# EAGLE schematic p2gs-001 (EAGLE 9.6.2)
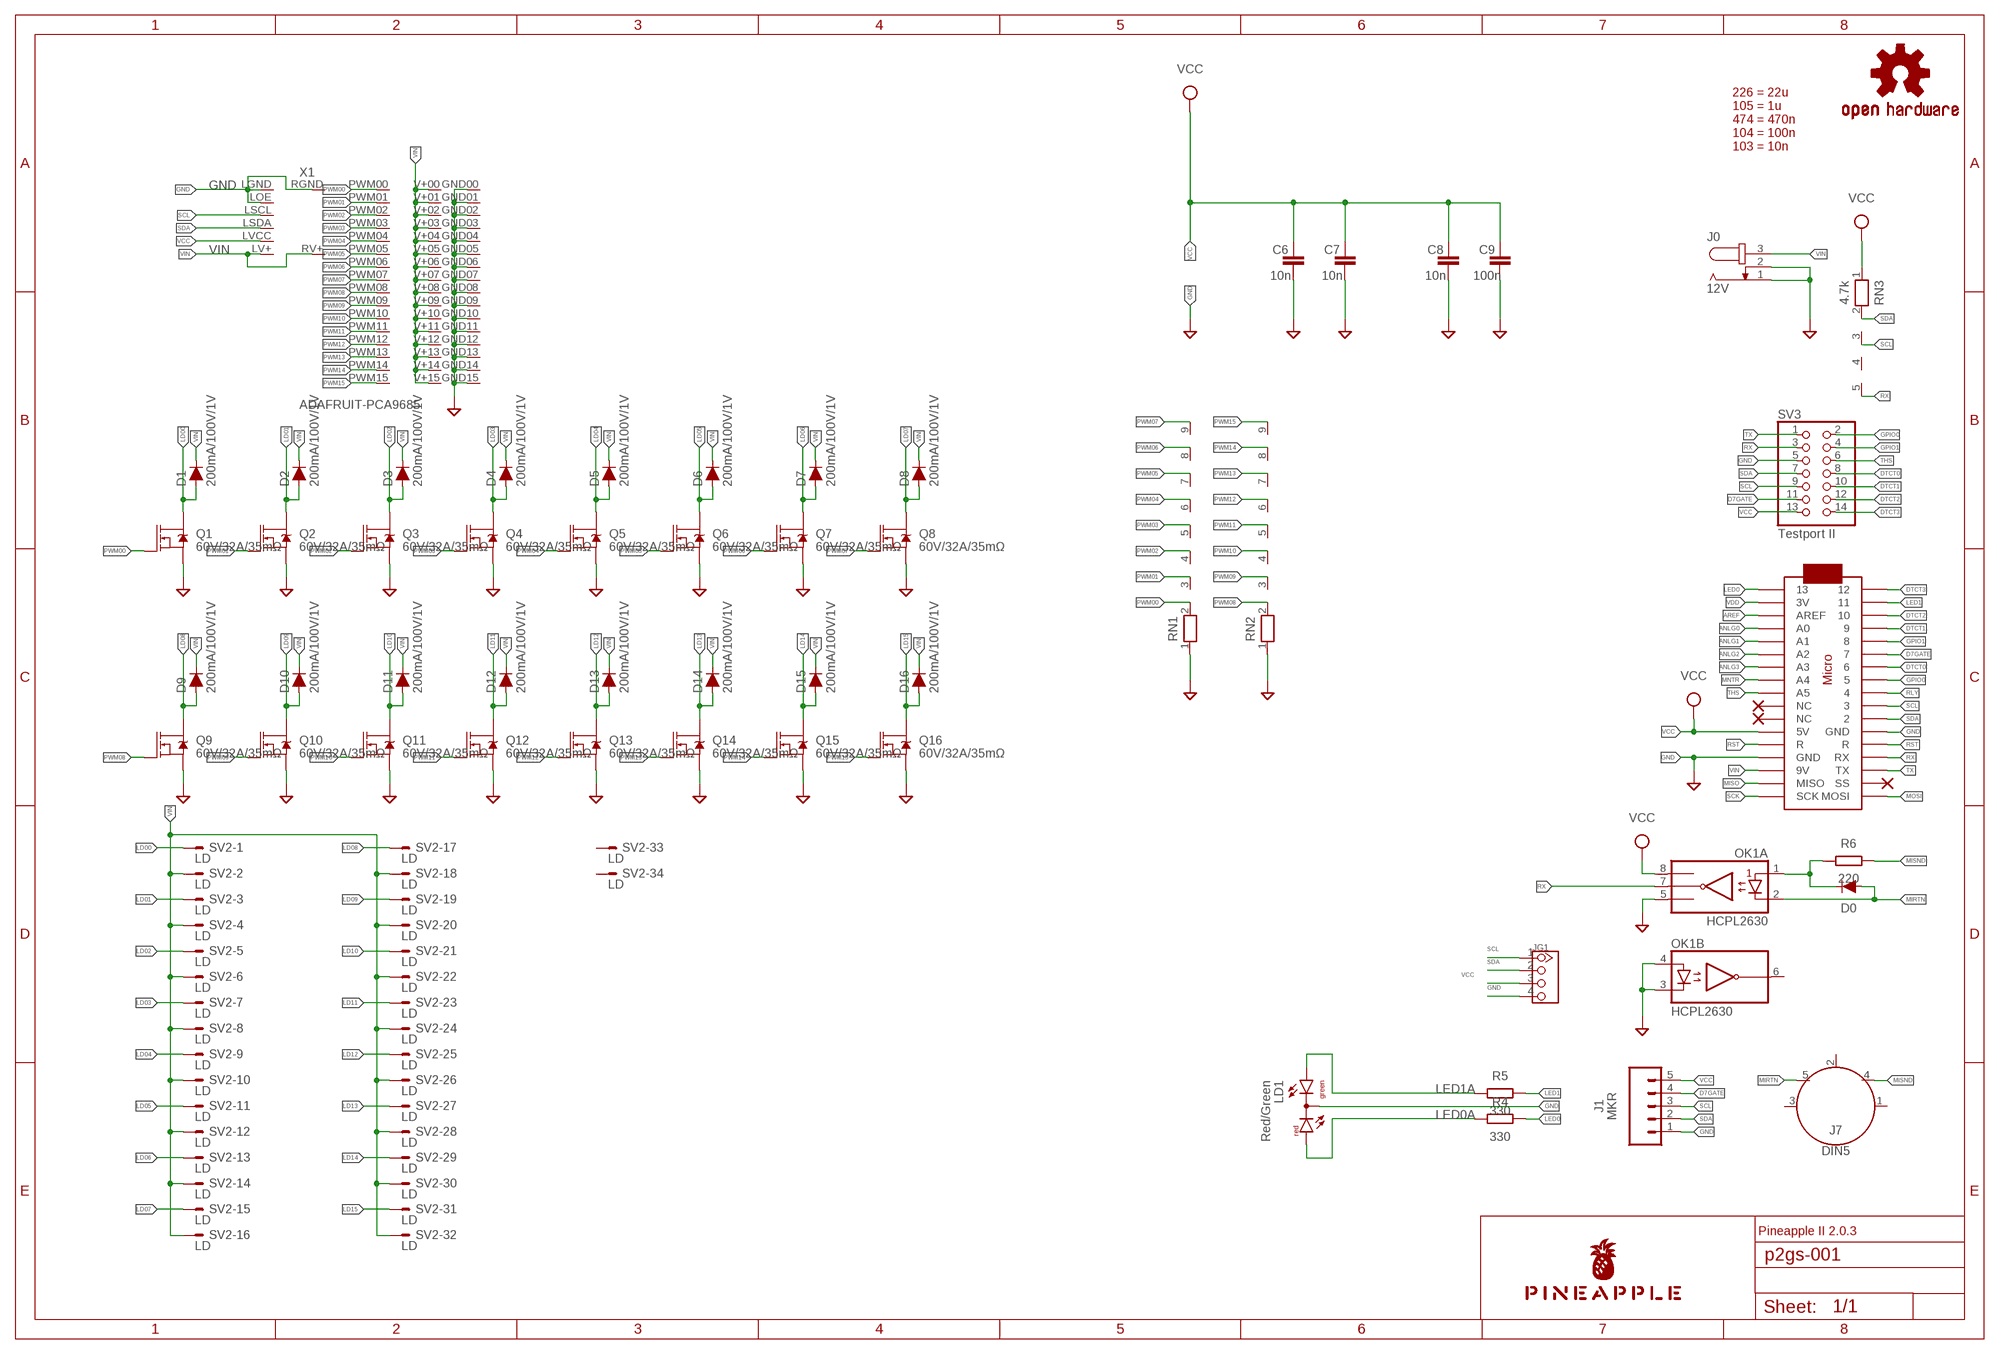
[diagram p0: schematic, sheet 1]

## Parts
C6  10n  C-EU025-024X044  [C025-024X044]
C7  10n  C-EU025-024X044  [C025-024X044]
C8  10n  C-EU025-024X044  [C025-024X044]
C9  100n  C-EU025-024X044  [C025-024X044]
D0  DIODE-1N4148  [DIODE-1N4148]
D1  200mA/100V/1V  DIODE-1N4148  [DIODE-1N4148]
D2  200mA/100V/1V  DIODE-1N4148  [DIODE-1N4148]
D3  200mA/100V/1V  DIODE-1N4148  [DIODE-1N4148]
D4  200mA/100V/1V  DIODE-1N4148  [DIODE-1N4148]
D5  200mA/100V/1V  DIODE-1N4148  [DIODE-1N4148]
D6  200mA/100V/1V  DIODE-1N4148  [DIODE-1N4148]
D7  200mA/100V/1V  DIODE-1N4148  [DIODE-1N4148]
D8  200mA/100V/1V  DIODE-1N4148  [DIODE-1N4148]
D9  200mA/100V/1V  DIODE-1N4148  [DIODE-1N4148]
D10  200mA/100V/1V  DIODE-1N4148  [DIODE-1N4148]
D11  200mA/100V/1V  DIODE-1N4148  [DIODE-1N4148]
D12  200mA/100V/1V  DIODE-1N4148  [DIODE-1N4148]
D13  200mA/100V/1V  DIODE-1N4148  [DIODE-1N4148]
D14  200mA/100V/1V  DIODE-1N4148  [DIODE-1N4148]
D15  200mA/100V/1V  DIODE-1N4148  [DIODE-1N4148]
D16  200mA/100V/1V  DIODE-1N4148  [DIODE-1N4148]
J0  12V  JACK-PLUG0  [SPC4077]
J1  MKR  CONN_05JST  [JST-5-PTH]
J7  DIN5  [DIN5-RA-PTH]
JG1  TWIG-4P-2.0'90D'  [4P-2.0-90D]
LD1  Red/Green  DUOLED-RG-C  [DUOLED-C-5MM]
LOGO1  OSHW-LOGOS-COPPER  [OSHW-LOGO-S_COPPER]
MC1  ARDUINOMICRO  [ARDUINOMICRO]
OK1  HCPL2630  [DIL08]
Q1  60V/32A/35mΩ  MOSFET-NCH-FQP30N06L  [TO220V]
Q2  60V/32A/35mΩ  MOSFET-NCH-FQP30N06L  [TO220V]
Q3  60V/32A/35mΩ  MOSFET-NCH-FQP30N06L  [TO220V]
Q4  60V/32A/35mΩ  MOSFET-NCH-FQP30N06L  [TO220V]
Q5  60V/32A/35mΩ  MOSFET-NCH-FQP30N06L  [TO220V]
Q6  60V/32A/35mΩ  MOSFET-NCH-FQP30N06L  [TO220V]
Q7  60V/32A/35mΩ  MOSFET-NCH-FQP30N06L  [TO220V]
Q8  60V/32A/35mΩ  MOSFET-NCH-FQP30N06L  [TO220V]
Q9  60V/32A/35mΩ  MOSFET-NCH-FQP30N06L  [TO220V]
Q10  60V/32A/35mΩ  MOSFET-NCH-FQP30N06L  [TO220V]
Q11  60V/32A/35mΩ  MOSFET-NCH-FQP30N06L  [TO220V]
Q12  60V/32A/35mΩ  MOSFET-NCH-FQP30N06L  [TO220V]
Q13  60V/32A/35mΩ  MOSFET-NCH-FQP30N06L  [TO220V]
Q14  60V/32A/35mΩ  MOSFET-NCH-FQP30N06L  [TO220V]
Q15  60V/32A/35mΩ  MOSFET-NCH-FQP30N06L  [TO220V]
Q16  60V/32A/35mΩ  MOSFET-NCH-FQP30N06L  [TO220V]
R4  330  R-EU_0204/5  [0204/5]
R5  330  R-EU_0204/5  [0204/5]
R6  220  R-EU_0204/5  [0204/5]
RN1  RN08  [RN-9]
RN2  RN08  [RN-9]
RN3  4.7k  RN04  [RN-5]
SV2  LD  ML34LE  [ML34L]
SV3  Testport II  PINHD-2X7  [2X07]
U$1  PINEAPPLE450_SILK  [PINEAPPLE450_SILK]
X1  ADAFRUIT-PCA9685  [ADAFRUIT-PCA9685-FOOTPRINT]

## Nets
ANLG0 [analog]: MC1.P$31(A0)
ANLG1 [analog]: MC1.P$30(A1)
ANLG2 [analog]: MC1.P$29(A2)
ANLG3 [analog]: MC1.P$28(A3)
AREF: MC1.P$32(AREF)
D7GATE: J1.4 MC1.P$6 SV3.11
DTCT0: MC1.P$7 SV3.8
DTCT1: MC1.P$4 SV3.10
DTCT2: MC1.P$3 SV3.12
DTCT3: MC1.P$1 SV3.14
GND [gnd]: C6.2 C7.2 C8.2 C9.2 J0.1 J0.2 J1.1 JG1.4 LD1.C MC1.P$12(GND) MC1.P$21(GND) OK1.3(B:C2) OK1.4(B:A2) OK1.5(A:GND) Q1.3(S) Q2.3(S) Q3.3(S) Q4.3(S) Q5.3(S) Q6.3(S) Q7.3(S) Q8.3(S) Q9.3(S) Q10.3(S) Q11.3(S) Q12.3(S) Q13.3(S) Q14.3(S) Q15.3(S) Q16.3(S) RN1.1 RN2.1 SV3.5 X1.GND00 X1.GND01 X1.GND02 X1.GND03 X1.GND04 X1.GND05 X1.GND06 X1.GND07 X1.GND08 X1.GND09 X1.GND10 X1.GND11 X1.GND12 X1.GND13 X1.GND14 X1.GND15 X1.LGND X1.LOE X1.RGND
GPIO0: MC1.P$8 SV3.2
GPIO1: MC1.P$5 SV3.4
LD00: D1.A Q1.2(D) SV2.1
LD01: D2.A Q2.2(D) SV2.3
LD02: D3.A Q3.2(D) SV2.5
LD03: D4.A Q4.2(D) SV2.7
LD04: D5.A Q5.2(D) SV2.9
LD05: D6.A Q6.2(D) SV2.11
LD06: D7.A Q7.2(D) SV2.13
LD07: D8.A Q8.2(D) SV2.15
LD08: D9.A Q9.2(D) SV2.17
LD09: D10.A Q10.2(D) SV2.19
LD10: D11.A Q11.2(D) SV2.21
LD11: D12.A Q12.2(D) SV2.23
LD12: D13.A Q13.2(D) SV2.25
LD13: D14.A Q14.2(D) SV2.27
LD14: D15.A Q15.2(D) SV2.29
LD15: D16.A Q16.2(D) SV2.31
LED0: MC1.P$34 R4.2
LED0A: LD1.AR R4.1
LED1: MC1.P$2 R5.2
LED1A: LD1.AX(AG) R5.1
MIDIINSND: D0.C OK1.1(A:A1) R6.1
MIRTN: D0.A J7.5 OK1.2(A:C1)
MISND: J7.4 R6.2
MISO: MC1.P$19(MISO)
MNTR: MC1.P$27(A4)
MOSI: MC1.P$17(MOSI)
PWM00: Q1.1(G) RN1.2 X1.PWM00
PWM01: Q2.1(G) RN1.3 X1.PWM01
PWM02: Q3.1(G) RN1.4 X1.PWM02
PWM03: Q4.1(G) RN1.5 X1.PWM03
PWM04: Q5.1(G) RN1.6 X1.PWM04
PWM05: Q6.1(G) RN1.7 X1.PWM05
PWM06: Q7.1(G) RN1.8 X1.PWM06
PWM07: Q8.1(G) RN1.9 X1.PWM07
PWM08: Q9.1(G) RN2.2 X1.PWM08
PWM09: Q10.1(G) RN2.3 X1.PWM09
PWM10: Q11.1(G) RN2.4 X1.PWM10
PWM11: Q12.1(G) RN2.5 X1.PWM11
PWM12: Q13.1(G) RN2.6 X1.PWM12
PWM13: Q14.1(G) RN2.7 X1.PWM13
PWM14: Q15.1(G) RN2.8 X1.PWM14
PWM15: Q16.1(G) RN2.9 X1.PWM15
RLY: MC1.P$9
RST: MC1.P$13(R) MC1.P$22(R)
RX: MC1.P$14(RX) OK1.7(A:VO1) RN3.5 SV3.3
SCK: MC1.P$18(SCK)
SCL: J1.3 JG1.1 MC1.P$10 RN3.3 SV3.9 X1.LSCL
SDA: J1.2 JG1.2 MC1.P$11 RN3.2 SV3.7 X1.LSDA
THS: MC1.P$26(A5) SV3.6
TX: MC1.P$15(TX) SV3.1
VCC [power]: C6.1 C7.1 C8.1 C9.1 J1.5 JG1.3 MC1.P$23(5V) OK1.8(A:VCC) RN3.1 SV3.13 X1.LVCC
VDD [power]: MC1.P$33(3V)
VIN [superpower]: D1.C D2.C D3.C D4.C D5.C D6.C D7.C D8.C D9.C D10.C D11.C D12.C D13.C D14.C D15.C D16.C J0.3 MC1.P$20(9V) SV2.2 SV2.4 SV2.6 SV2.8 SV2.10 SV2.12 SV2.14 SV2.16 SV2.18 SV2.20 SV2.22 SV2.24 SV2.26 SV2.28 SV2.30 SV2.32 X1.LV+ X1.RV+ X1.V+00 X1.V+01 X1.V+02 X1.V+03 X1.V+04 X1.V+05 X1.V+06 X1.V+07 X1.V+08 X1.V+09 X1.V+10 X1.V+11 X1.V+12 X1.V+13 X1.V+14 X1.V+15
Unconnected: J7.1 J7.2 J7.3 MC1.P$16(SS) MC1.P$24(NC) MC1.P$25(NC) OK1.6(B:VO2) RN3.4 SV2.33 SV2.34

## Notes on the sheet
- 226 = 22u
  105 = 1u
  474 = 470n
  104 = 100n
  103 = 10n
- Pineapple II 2.0.3

## Library data of the parts
C6-C9 = resistor:C-EU: CAPACITOR, European symbol
D0 = SparkFun-DiscreteSemi:DIODE: Diode These are standard reverse protection diodes and small signal diodes. SparkFun Products: SparkFun SparkPunk Sound Kit <https://www.sparkfun.com/products/11177> SparkFun ESP8266 Thing <https://www.sparkfun.com/products/13231>; PROD_ID: DIO-08378; VALUE: 200mA/100V/1V
D1-D16 = SparkFun-DiscreteSemi:DIODE: Diode These are standard reverse protection diodes and small signal diodes. SparkFun Products: SparkFun SparkPunk Sound Kit <https://www.sparkfun.com/products/11177> SparkFun ESP8266 Thing <https://www.sparkfun.com/products/13231>; PROD_ID: DIO-08378
J0 = con-jack:JACK-PLUG: DC POWER JACK Power Jack, DC, Right Angle, Through Hole, Rated 5A at 16VDC, PC Terminals Distributor: Farnell (www.Farnell.de) Drawing: 84N1161.pdf / 84N1162.pdf Manufacturer: SPC Technology (www.spctechnology.com) Type: SPC4077 / SPC 4078; OC_FARNELL: unknown; OC_NEWARK: unknown
J1 = SparkFun-Connectors:CONN_05: Multi connection point. Often used as Generic Header-pin footprint for 0.1 inch spaced/style header connections On any of the 0.1 inch spaced packages, you can populate with these: Break Away Headers - Straight <https://www.sparkfun.com/products/116> (PRT-00116) Break Away Male Headers - Right Angle <https://www.sparkfun.com/products/553> (PRT-00553) Female Headers <https://www.sparkfun.com/products/115> (PRT-00115) Break Away Headers - Machine Pin <https://www.sparkfun.com/products/117> (PRT-00117) Break Away Female Headers - Swiss Machine Pin <https://www.sparkfun.com/products/743> (PRT-00743) For SCREWTERMINALS and SPRING TERMINALS visit here: Screw Terimnals on SparkFun.com <https://www.sparkfun.com/search/results?term=Screw+Terminals> (5mm/3.5mm/2.54mm spacing) This device is also useful as a general connection point to wire up your design to another part of your project. Our various solder wires solder well into these plated through hole pads. Hook-Up Wire - Assortment (Stranded, 22 AWG) <https://www.sparkfun.com/products/11375> (PRT-11375) Hook-Up Wire - Assortment (Solid Core, 22 AWG) <https://www.sparkfun.com/products/11367> (PRT-11367) View the entire wire category on our website here <https://www.sparkfun.com/categories/141> Special notes: Molex polarized connector foot print use with SKU : PRT-08231 with associated crimp pins and housings. 1MM SMD Version SKU: PRT-10208; SF_ID: PRT-09917
J7 = SparkFun-Connectors:DIN5: DIN5 Connector - Female Right Angle (frequently used as a MIDI Jack connector) This type of connector and cable is frequently used for transmitting midi data (musical instrument digital interface). It is what you usually see on a keyboard or set of electronic drums. Learn more here <https://en.wikipedia.org/wiki/MIDI>. For more information on the pinout and electrical specifications of MIDI communications, please see the following resource: https://www.midi.org/specifications/item/midi-din-electrical-specification Here is the connector we sell at SparkFun: MIDI Connector - Female Right Angle <https://www.sparkfun.com/products/9536> (PRT-09536) Datasheet <hhttp://www.sparkfun.com/datasheets/Prototyping/Connectors/MIDI-RA.pdf> It is used on this SparkFun product: SparkFun MIDI Shield <https://www.sparkfun.com/products/12898> (DEV-12898); PROD_ID: CONN-09481
JG1 = Connector:TWIG-4P-2.0
LD1 = led:DUOLED-RG-C: DUO LED 2 colors (red/green), 5 mm, round, common Cathode www.ligitek.com or other producers.
LOGO1 = SparkFun-Aesthetics:OSHW-LOGO: Open-Source Hardware (OSHW) Logo This logo indicates the piece of hardware it is found on incorporates a OSHW license and/or adheres to the definition of open source hardware found here: http://freedomdefined.org/OSHW
MC1 = adafruit:ARDUINOMICRO
OK1 = optocoupler:HCPL2630: HEWLETT PACKARD OPTO COUPLER; MF: AGILENT TECHNOLOGIES; MPN: HCPL-2630-000E; OC_FARNELL: 9994904; OC_NEWARK: 88H7813
Q1-Q16 = SparkFun-DiscreteSemi:MOSFET-NCH: N-channel MOSFETs Voltage controlled devices that allow control of high current outputs. SparkFun Products: SparkFun OpenScale <https://www.sparkfun.com/products/13261> SparkFun Digital Sandbox <https://www.sparkfun.com/products/12651> SparkFun Monster Moto Shield <https://www.sparkfun.com/products/10182> SparkFun MOSFET Power Controller <https://www.sparkfun.com/products/11214>; PROD_ID: TRANS-10060
R4-R6 = resistor:R-EU_: RESISTOR, European symbol
RN1 RN2 = resistor-net:RN08: RESISTOR NETWORK; OC_FARNELL: unknown; OC_NEWARK: unknown
RN3 = resistor-net:RN04: RESISTOR NETWORK; OC_FARNELL: unknown; OC_NEWARK: unknown
SV2 = con-ml:ML34LE: HARTING; OC_FARNELL: unknown; OC_NEWARK: unknown
SV3 = pinhead:PINHD-2X7: PIN HEADER
U$1 = pineapple:PINEAPPLE450_SILK
X1 = adafruit-pca9685:ADAFRUIT-PCA9685: AQM0802A-RN-GBW LCD

## Net classes
0 default: width 0.152 mm, drill 0.152 mm, clearance 0.152 mm
1 gnd: width 0.305 mm, drill 0.152 mm, clearance 0.152 mm
2 power: width 0.508 mm, drill 0.152 mm, clearance 0.152 mm
3 analog: width 0.305 mm, drill 0.152 mm, clearance 0.152 mm
4 superpower: width 1.016 mm, drill 0.152 mm, clearance 0.152 mm